# Altium schematic sheet BOTAO.SchDoc
size A4; SheetNumber: 4; SheetTotal: 7; SPICEModelCacheDMJNRZEX: <root> / <DocumentId>DMJNRZEX</DocumentId> / <CacheFrame Number="0"> / <Model Name="cap" Kind="MDL"> / <Text>*Default semiconductor capacitor / .MODEL CAP C()</Text> / </Model> / </CacheFrame> / </root>
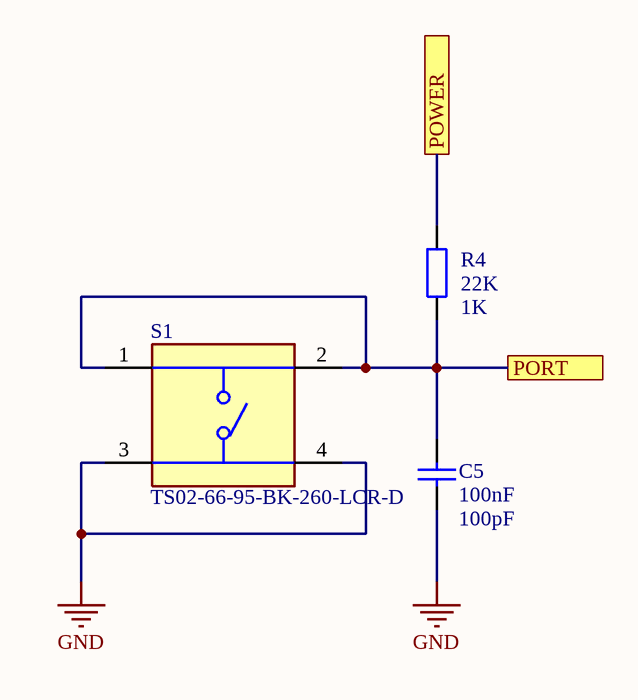
[diagram p0: BOTAO.SchDoc]

## Parts
C5  100nF  value 100pF  [RAD-0.3]
R4  22K  value 1K  [AXIAL-0.4]
S1  TS02-66-95-BK-260-LCR-D  [SW_TS02-66-95-BK-260-LCR-D]

## Ports
PORT, POWER

## Nets
GND: C5.1 S1.3 S1.4
PORT: C5.2 R4.1 S1.1 S1.2 ; port PORT
POWER: R4.2 ; port POWER

## Library data of the parts
C5 = Cap: Capacitor; Published: 8-Jun-2000; LatestRevisionDate: 17-Jul-2002; LatestRevisionNote: Re-released for DXP Platform.; PackageReference: RAD-0.3; Publisher: Altium Limited; PackageDescription: Radial Cap, Thru-Hole; 2 Leads; 0.3 in Pin Spacing
R4 = Res2: Resistor; Published: 8-Jun-2000; LatestRevisionDate: 17-Jul-2002; LatestRevisionNote: Re-released for DXP Platform.; PackageReference: AXIAL-0.4; Publisher: Altium Limited; PackageDescription: Axial Device, Thru-Hole; 2 Leads; 0.4 in Pin Spacing
S1 = TS02-66-95-BK-260-LCR-D: Price: None; Availability: Unavailable; MP: TS02-66-95-BK-260-LCR-D; Value: *; Package: None